# Altium schematic sheet SunS_RTD_Interface.SchDoc: RTD Interface
size A3
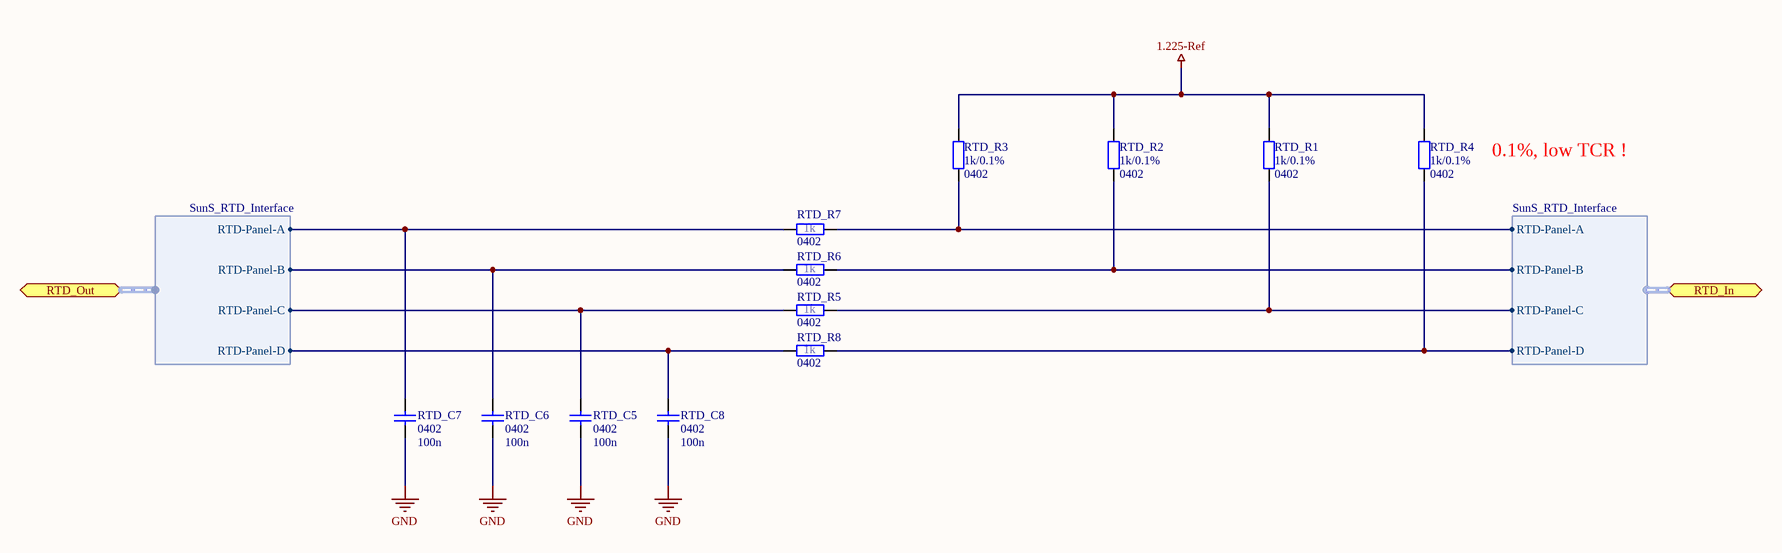
[diagram p0: SunS_RTD_Interface.SchDoc]

## Parts
RTD_C5  0402  value 100n  [SMD_Capacitor_0402]
RTD_C6  0402  value 100n  [SMD_Capacitor_0402]
RTD_C7  0402  value 100n  [SMD_Capacitor_0402]
RTD_C8  0402  value 100n  [SMD_Capacitor_0402]
RTD_R1  Package: 0402  [SMD_Resistor_0402]  (hidden comment: 1k/0.1%)
RTD_R2  Package: 0402  [SMD_Resistor_0402]  (hidden comment: 1k/0.1%)
RTD_R3  Package: 0402  [SMD_Resistor_0402]  (hidden comment: 1k/0.1%)
RTD_R4  Package: 0402  [SMD_Resistor_0402]  (hidden comment: 1k/0.1%)
RTD_R5  Package: 0402  [SMD_Resistor_0402]  (hidden comment: 1k)
RTD_R6  Package: 0402  [SMD_Resistor_0402]  (hidden comment: 1k)
RTD_R7  Package: 0402  [SMD_Resistor_0402]  (hidden comment: 1k)
RTD_R8  Package: 0402  [SMD_Resistor_0402]  (hidden comment: 1k)

## Ports
RTD_In (harness SunS_RTD_Interface), RTD_Out (harness SunS_RTD_Interface)

## Harnesses
SunS_RTD_Interface: RTD-Panel-A, RTD-Panel-B, RTD-Panel-C, RTD-Panel-D

## Nets
1.225-Ref: RTD_R1.1 RTD_R2.1 RTD_R3.1 RTD_R4.1
GND: RTD_C5.1 RTD_C6.1 RTD_C7.1 RTD_C8.1
NetRTD_C5_2: RTD_C5.2 RTD_R5.2 ; port RTD_Out.RTD-Panel-C
NetRTD_C6_2: RTD_C6.2 RTD_R6.2 ; port RTD_Out.RTD-Panel-B
NetRTD_C7_2: RTD_C7.2 RTD_R7.2 ; port RTD_Out.RTD-Panel-A
NetRTD_C8_2: RTD_C8.2 RTD_R8.2 ; port RTD_Out.RTD-Panel-D
NetRTD_R1_2: RTD_R1.2 RTD_R5.1 ; port RTD_In.RTD-Panel-C
NetRTD_R2_2: RTD_R2.2 RTD_R6.1 ; port RTD_In.RTD-Panel-B
NetRTD_R3_2: RTD_R3.2 RTD_R7.1 ; port RTD_In.RTD-Panel-A
NetRTD_R4_2: RTD_R4.2 RTD_R8.1 ; port RTD_In.RTD-Panel-D

## Notes on the sheet
- 0.1%, low TCR !
- Title:
- Project:
- Author:
- Model:
- Document Number:
- Checked by:
- Rev:
- Date:
- Approved by:
- Sheet:
- of
- File name:

## Library data of the parts
RTD_C5-RTD_C8 = Cap: Capacitor; Published: 8-Jun-2000; LatestRevisionDate: 17-Jul-2002; LatestRevisionNote: Re-released for DXP Platform.; PackageReference: RAD-0.3; Publisher: Altium Limited; PackageDescription: Radial Cap, Thru-Hole; 2 Leads; 0.3 in Pin Spacing
RTD_R1-RTD_R8 = CRCW04021K00FKxxxx: 1k/1% Vishay CRCW 0402 Resistor. 63mW, 100ppm, 50V.; Manufacturer: Vishay; ManufacturerPartNumber: CRCW04021K00FKxxxx
  RTD_R1-RTD_R4: Value: 1k/0.1%
  RTD_R5-RTD_R8: Value: 1k